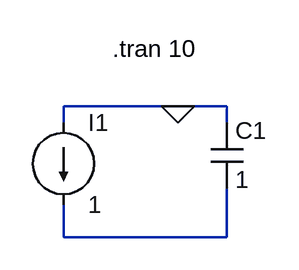
[diagram p0: schematic amplifier.asc]
amplifier.asc, the LTspice schematic file:
Version 4
SHEET 1 880 680
WIRE 464 240 352 240
WIRE 512 240 464 240
WIRE 352 256 352 240
WIRE 512 256 512 240
WIRE 352 368 352 336
WIRE 512 368 512 320
WIRE 512 368 352 368
FLAG 464 240 0
SYMBOL current 352 256 R0
SYMATTR InstName I1
SYMATTR Value 1
SYMBOL cap 496 256 R0
SYMATTR InstName C1
SYMATTR Value 1
TEXT 400 184 Left 2 !.tran 10

The netlist it stands for:
* amplifier.asc
I1 0 N001 1
C1 0 N001 1
.tran 10
.backanno
.end